# Altium schematic sheet mini_project.SchDoc
size A
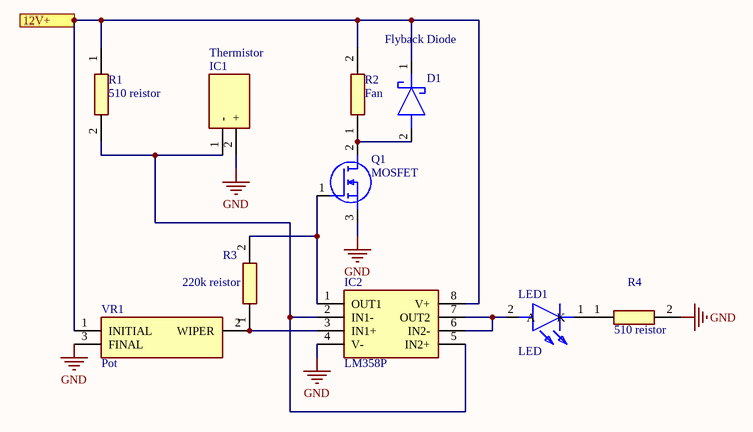
[diagram p0: mini_project.SchDoc]

## Parts
D1  Flyback Diode  [DIOAD950W60L350D150]
IC1  Thermistor  [LMT01QLPGQ1]
IC2  LM358P  [DIP794W53P254L959H508Q8N]
LED1  LED  [C543AWMNCCCKK141]
Q1  MOSFET  [TO254P470X1016X2019-3P]
R1  510 reistor  [RESAD3750W83L1670D520]
R2  Fan  [RESAD3750W83L1670D520]
R3  220k reistor  [RESAD3750W83L1670D520]
R4  510 reistor  [RESAD3750W83L1670D520]
VR1  Pot  [PT10LV10224A2020PMS]

## Ports
12V+

## Nets
GND: IC1.2(+) IC2.4(V-) Q1.3(S) R4.2 VR1.3(FINAL)
12V+: D1.1(K) IC2.8(V+) R1.1 R2.2 VR1.1(INITIAL) ; port 12V+
NetD1_2: D1.2(A) Q1.2(D) R2.1
NetIC1_1: IC1.1(-) IC2.2(IN1-) IC2.5(IN2+) R1.2
NetIC2_1: IC2.1(OUT1) Q1.1(G) R3.2
NetIC2_3: IC2.3(IN1+) R3.1 VR1.2(WIPER)
NetIC2_6: IC2.6(IN2-) IC2.7(OUT2) LED1.2(A)
NetLED1_1: LED1.1(K) R4.1

## Library data of the parts
D1 = SD101A-TR: Manufacturer_Name: Vishay; Datasheet Link: https://componentsearchengine.com/Datasheets/5/SD101A-TR.pdf; Manufacturer_Part_Number: SD101A-TR
IC1 = TMP6131LPGM: Manufacturer_Name: Texas Instruments; Datasheet Link: https://www.ti.com/lit/gpn/TMP61; Height: 5.3mm; Manufacturer_Part_Number: TMP6131LPGM
IC2 = LM358P: Integrated Circuit; Manufacturer_Name: Texas Instruments; Datasheet Link: http://www.ti.com/lit/ds/symlink/lm358a.pdf; Height: 5.08mm; Mouser2 Part Number: 595-LM358P; Mouser2 Price/Stock: https://www.mouser.com/Search/Refine.aspx?Keyword=595-LM358P; Manufacturer_Part_Number: LM358P
LED1 = C543A-WMN-CCCKK141: Manufacturer_Name: Cree; Datasheet Link: https://componentsearchengine.com//C543A-WMN-CCCKK141.pdf; Height: 8.7mm; Mouser2 Part Number: 941-C543AWMNCCCKK141; Mouser2 Price/Stock: https://www.mouser.com/Search/Refine.aspx?Keyword=941-C543AWMNCCCKK141; Manufacturer_Part_Number: C543A-WMN-CCCKK141
Q1 = NTP095N65S3HF: Manufacturer_Name: ON Semiconductor; Datasheet Link: https://componentsearchengine.com//NTP095N65S3HF.pdf; Height: 4.7mm; Mouser2 Part Number: 863-NTP095N65S3HF; Mouser2 Price/Stock: https://www.mouser.com/Search/Refine.aspx?Keyword=863-NTP095N65S3HF; Manufacturer_Part_Number: NTP095N65S3HF
R1-R4 = PR03000205100JAC00: Manufacturer_Name: Vishay; Datasheet Link: http://www.vishay.com/docs/28729/pr010203.pdf; Manufacturer_Part_Number: PR03000205100JAC00
VR1 = PT10LV10-224A2020-PM-S: Manufacturer_Name: PIHER; Datasheet Link: https://componentsearchengine.com//PT10LV10-224A2020-PM-S.pdf; Height: 4.8mm; Mouser2 Part Number: 531-PT1LV1224A22PMS; Mouser2 Price/Stock: https://www.mouser.com/Search/Refine.aspx?Keyword=531-PT1LV1224A22PMS; Manufacturer_Part_Number: PT10LV10-224A2020-PM-S